# EAGLE design ventmon_t0.5i (EAGLE 9.6.2)
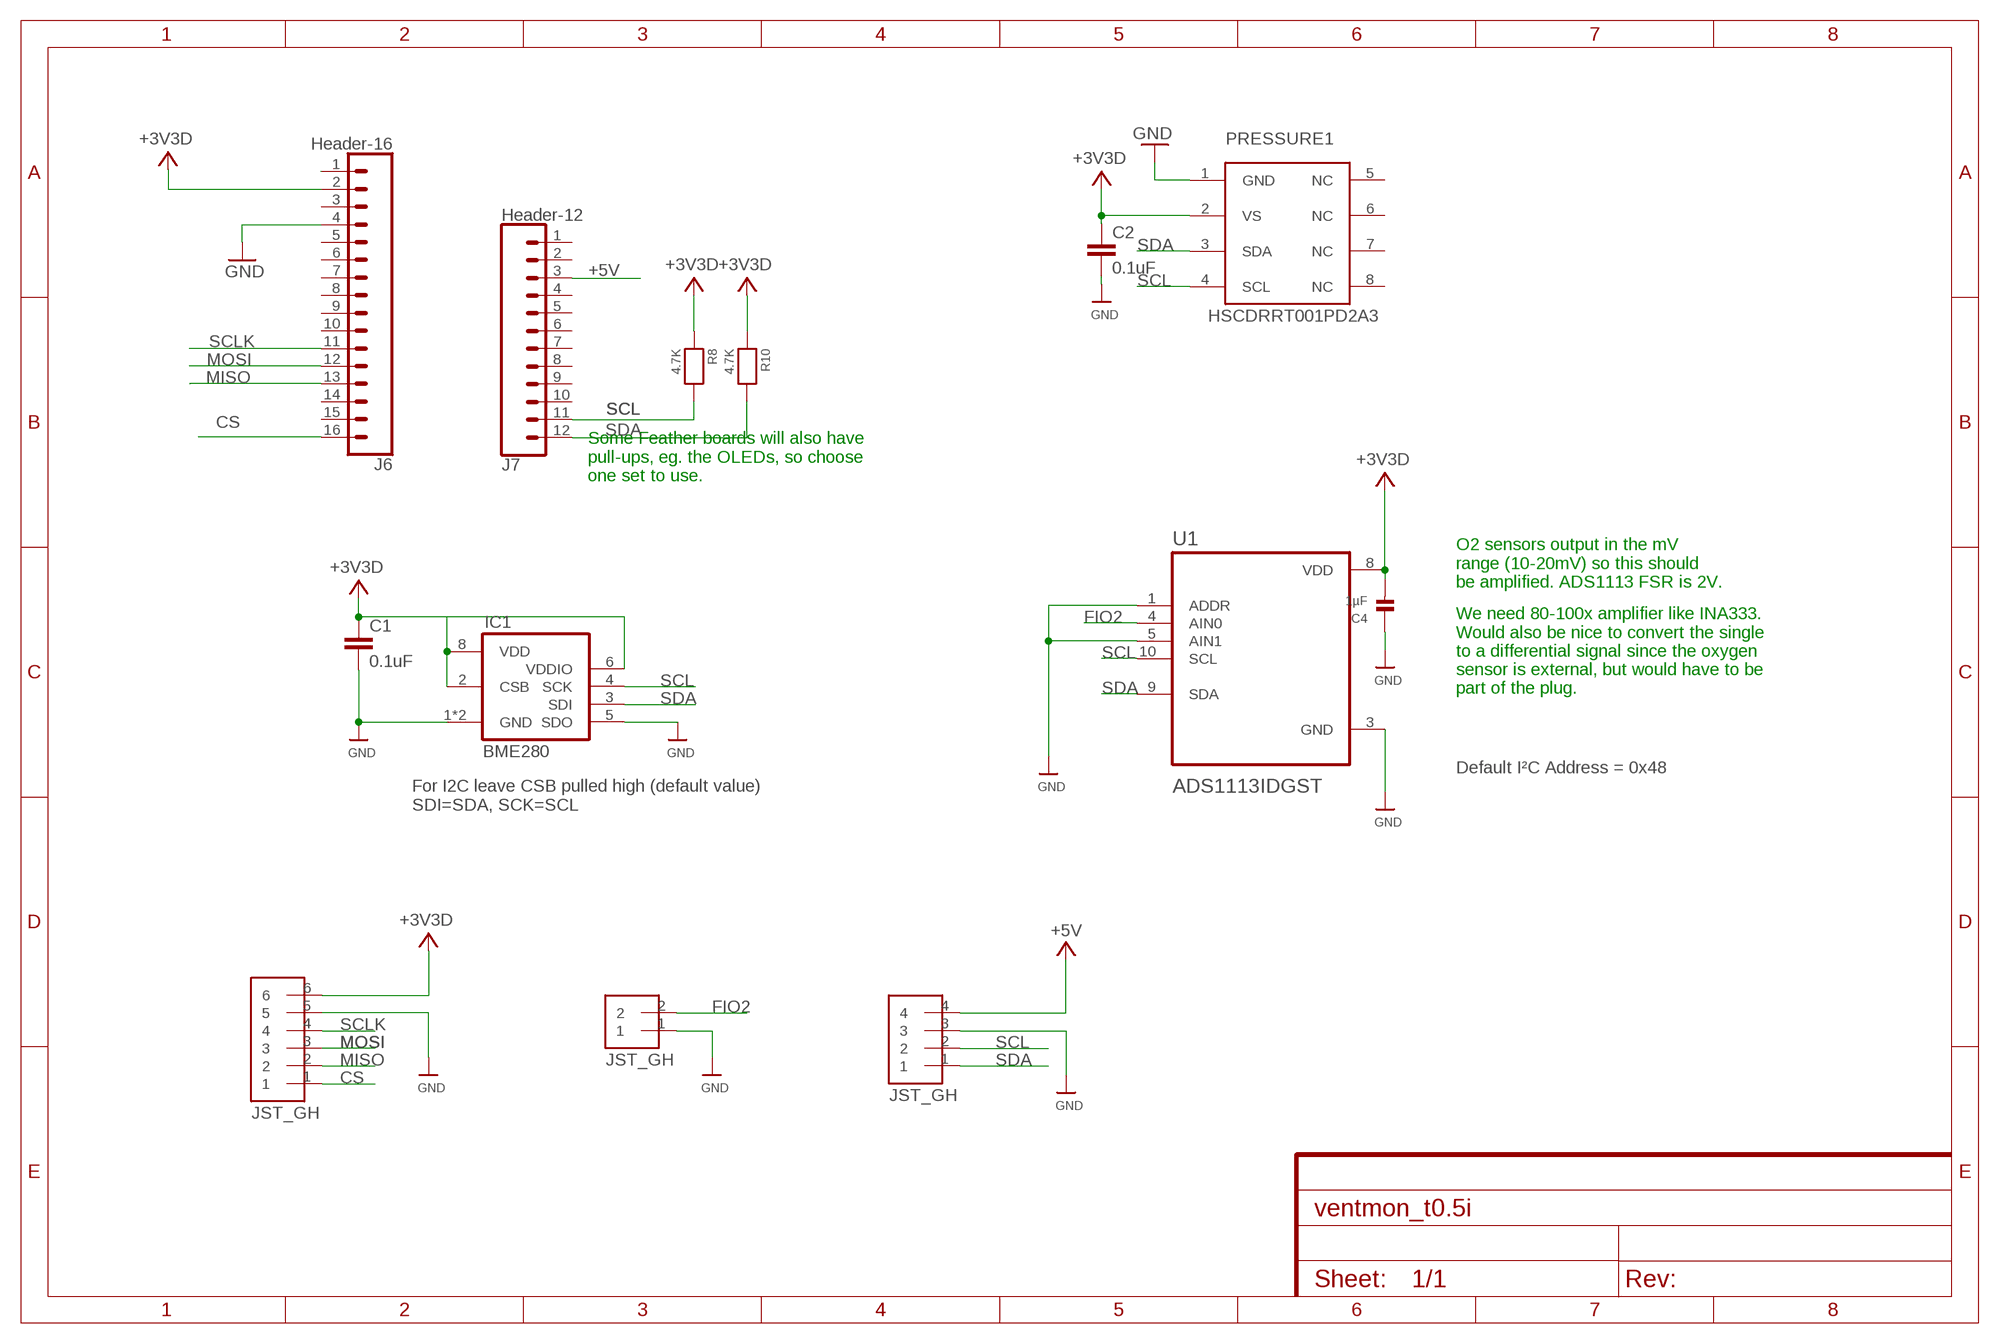
[diagram p0: schematic, sheet 1]

## Parts
C1  0.1uF  0.1UF-0603-25V-5%  [0603]
C2  0.1uF  0.1UF-0603-25V-5%  [0603]
C4  1µF  CAP_CERAMIC0603  [0603]
IC1  BME280  [BME280]
J6  Header-16  CONN_16  [1X16]
J7  Header-12  CONN_12  [1X12]
PRESSURE1  HSCDRRT001PD2A3  [DIP1330W46P254L1000H616Q8B]
R8  4.7K  RESISTOR0603  [0603]
R10  4.7K  RESISTOR0603  [0603]
U1  ADS1113IDGST  [SOP50P490X110-10N]
U$5  JST_GH_4  [JST_GH_4]
U$6  JST_GH_6  [JST_GH_6]
U$12  JST_GH_2  [JST_GH_2]

## Nets
+3V3: C1.1 C2.1 C4.2 IC1.2(CSB) IC1.6(VDDIO) IC1.8(VDD) J6.2 PRESSURE1.2(VS) R8.1 R10.1 U1.8(VDD) U$6.6 ; supply symbol labelled +3V3D
+5V: J7.3 U$5.4
CS: J6.16 U$6.1
FIO2: U1.4(AIN0) U$12.2
GND: C1.2 C2.2 C4.1 IC1.1(GND) IC1.5(SDO) IC1.7(GND) J6.4 PRESSURE1.1(GND) U1.1(ADDR) U1.3(GND) U1.5(AIN1) U$5.3 U$6.5 U$12.1
MISO: J6.13 U$6.2
MOSI: J6.12 U$6.3
N$4: J6.1
SCL: IC1.4(SCK) J7.11 PRESSURE1.4(SCL) R8.2 U1.10(SCL) U$5.2
SCLK: J6.11 U$6.4
SDA: IC1.3(SDI) J7.12 PRESSURE1.3(SDA) R10.2 U1.9(SDA) U$5.1
Unconnected: J6.3 J6.5 J6.6 J6.7 J6.8 J6.9 J6.10 J6.14 J6.15 J7.1 J7.2 J7.4 J7.5 J7.6 J7.7 J7.8 J7.9 J7.10 PRESSURE1.5(NC) PRESSURE1.6(NC) PRESSURE1.7(NC) PRESSURE1.8(NC)

## Notes on the sheet
- Some Feather boards will also have
  pull-ups, eg. the OLEDs, so choose
  one set to use.
- O2 sensors output in the mV
  range (10-20mV) so this should
  be amplified. ADS1113 FSR is 2V.
- We need 80-100x amplifier like INA333.
  Would also be nice to convert the single
  to a differential signal since the oxygen
  sensor is external, but would have to be
  part of the plug.
- Default I²C Address = 0x48
- For I2C leave CSB pulled high (default value)
  SDI=SDA, SCK=SCL

## Library data of the parts
C1 C2 = SparkFun-Capacitors:0.1UF: 0.1µF ceramic capacitors A capacitor is a passive two-terminal electrical component used to store electrical energy temporarily in an electric field.; PROD_ID: CAP-08604
C4 = microbuilder:CAP_CERAMIC: Ceramic Capacitors 0402 - 0402 Surface Mount Capacitors 16pF 50V 5% [Digikey: 445-4899-2-ND] 18pF 50V 5% [Digikey: 490-1281-2-ND] 22pF 50V 5% [Digikey: 490-1283-2-ND] 68pF 50V 5% [Digikey: 490-1289-2-ND] 0.1uF 10V 10% [Digikey: 490-1318-2-ND] 1.0uF 6.3V 10% [Digikey: 490-1320-2-ND] 0603 - 0603 Surface Mount Capacitors 16 pF 50V 5% [Digikey: 445-5051-2-ND] 22 pF 50V [Digikey: PCC220ACVTR-ND] 33 pF 50V 5% [Digikey: 490-1415-1-ND] 56pF 50V 5% [Digikey: 490-1421-1-ND] 220pF 50V 5% [Digikey: 445-1285-1-ND] 680 pF 50V 2200 pF 50V 5% C0G [Digikey: 445-1297-1-ND] 5600 pF 100V 5% X7R [Digikey: 478-3711-1-ND] 0.1 µF 25V 10% [Digikey: PCC2277TR-ND] 0.22 µF 16V 10% X7R [Digikey: 445-1318-1-ND] 1.0 µF 25V 10% [Digikey: 445-5146-2-ND] 0603 - RF Specific 3pF 250V +/-0.1pF RF [Digikey: 712-1347-1-ND] 18 pF 250V 5% [Digikey: 478-3505-1-ND or 712-1322-1-ND] 56 pF 250V 5% C0G RF [Digikey: 490-4867-1-ND] 68 pF 250V RF [Digikey: 490-4868-1-ND] 0805 - 0805 Surface Mount Capacitors 220 pF 250V 2% RF Ceramic Capacitor [Digikey: 712-1398-1-ND] 1000 pF 50V 2% NP0 Ceramic Capacitor [Digikey: 478-3760-1-ND] 0.1 µF 25V 10% Ceramic Capacitor [Digikey: PCC1828TR-ND] 1.0 µF 16V 10% Ceramic Capacitor[Digikey: 490-1691-2-ND] 10.0 µF 10V 10% Ceramic Capacitor[Digikey: 709-1228-1-ND] 10.0 uF 16V 10% Ceramic Capacitor [Digikey: 478-5165-2-ND] 47 uF 6.3V 20% Ceramic Capacitor [Digikey: 587-1779-1-ND or 399-5506-1-ND] 1206 - 1206 Surface Mount Capacitors 47uF 10V 20% Ceramic Capacitor [Digikey: 490-5528-1-ND or 399-5508-1-ND or 445-6010-1-ND] 100uF 6.3V -20%, +80% Y5V Ceramic Capacitor (Digikey: 490-4512-1-ND, Mouser: 81-GRM31CF50J107ZE1L)
IC1 = bosch-bme280:BME280: DIGITAL HUMIDITY, PRESSURE AND TEMPERATURE SENSOR * Digital interface I²C (up to 3.4 MHz) and SPI (3 and 4 wire, up to 10 MHz)* Supply voltage VDD main supply voltage range: 1.71 V to 3.6 V*VDDIO interface voltage range: 1.2 V to 3.6 V Operating range -40…+85 °C, 0…100 % rel. humidity, 300…1100 hPa The library has been designed by Richard Magdycz <https://www.facebook.com/groups/eaglecadsoftUK>
J6 = SparkFun-Connectors:CONN_16: Multi connection point. Often used as Generic Header-pin footprint for 0.1 inch spaced/style header connections On any of the 0.1 inch spaced packages, you can populate with these: Break Away Headers - Straight <https://www.sparkfun.com/products/116> (PRT-00116) Break Away Male Headers - Right Angle <https://www.sparkfun.com/products/553> (PRT-00553) Female Headers <https://www.sparkfun.com/products/115> (PRT-00115) Break Away Headers - Machine Pin <https://www.sparkfun.com/products/117> (PRT-00117) Break Away Female Headers - Swiss Machine Pin <https://www.sparkfun.com/products/743> (PRT-00743) For SCREWTERMINALS and SPRING TERMINALS visit here: Screw Terimnals on SparkFun.com <https://www.sparkfun.com/search/results?term=Screw+Terminals> (5mm/3.5mm/2.54mm spacing) This device is also useful as a general connection point to wire up your design to another part of your project. Our various solder wires solder well into these plated through hole pads. Hook-Up Wire - Assortment (Stranded, 22 AWG) <https://www.sparkfun.com/products/11375> (PRT-11375) Hook-Up Wire - Assortment (Solid Core, 22 AWG) <https://www.sparkfun.com/products/11367> (PRT-11367) View the entire wire category on our website here <https://www.sparkfun.com/categories/141> Special notes: Molex polarized connector foot print use with SKU : PRT-08231 with associated crimp pins and housings. 1MM SMD Version SKU: PRT-10208 NOTES ON THE VARIANTS LOCK and LOCK_LONGPADS... This footprint was designed to help hold the alignment of a through-hole component (i.e. 6-pin header) while soldering it into place. You may notice that each hole has been shifted either up or down by 0.005 of an inch from it's more standard position (which is a perfectly straight line). This slight alteration caused the pins (the squares in the middle) to touch the edges of the holes. Because they are alternating, it causes a "brace" to hold the component in place. 0.005 has proven to be the perfect amount of "off-center" position when using our standard breakaway headers. Although looks a little odd when you look at the bare footprint, once you have a header in there, the alteration is very hard to notice. Also,if you push a header all the way into place, it is covered up entirely on the bottom side.
J7 = SparkFun-Connectors:CONN_12: Multi connection point. Often used as Generic Header-pin footprint for 0.1 inch spaced/style header connections On any of the 0.1 inch spaced packages, you can populate with these: Break Away Headers - Straight <https://www.sparkfun.com/products/116> (PRT-00116) Break Away Male Headers - Right Angle <https://www.sparkfun.com/products/553> (PRT-00553) Female Headers <https://www.sparkfun.com/products/115> (PRT-00115) Break Away Headers - Machine Pin <https://www.sparkfun.com/products/117> (PRT-00117) Break Away Female Headers - Swiss Machine Pin <https://www.sparkfun.com/products/743> (PRT-00743) For SCREWTERMINALS and SPRING TERMINALS visit here: Screw Terimnals on SparkFun.com <https://www.sparkfun.com/search/results?term=Screw+Terminals> (5mm/3.5mm/2.54mm spacing) This device is also useful as a general connection point to wire up your design to another part of your project. Our various solder wires solder well into these plated through hole pads. Hook-Up Wire - Assortment (Stranded, 22 AWG) <https://www.sparkfun.com/products/11375> (PRT-11375) Hook-Up Wire - Assortment (Solid Core, 22 AWG) <https://www.sparkfun.com/products/11367> (PRT-11367) View the entire wire category on our website here <https://www.sparkfun.com/categories/141> Special notes: Molex polarized connector foot print use with SKU : PRT-08231 with associated crimp pins and housings. 1MM SMD Version SKU: PRT-10208 NOTES ON THE VARIANTS LOCK and LOCK_LONGPADS... This footprint was designed to help hold the alignment of a through-hole component (i.e. 6-pin header) while soldering it into place. You may notice that each hole has been shifted either up or down by 0.005 of an inch from it's more standard position (which is a perfectly straight line). This slight alteration caused the pins (the squares in the middle) to touch the edges of the holes. Because they are alternating, it causes a "brace" to hold the component in place. 0.005 has proven to be the perfect amount of "off-center" position when using our standard breakaway headers. Although looks a little odd when you look at the bare footprint, once you have a header in there, the alteration is very hard to notice. Also,if you push a header all the way into place, it is covered up entirely on the bottom side.
PRESSURE1 = HSCDRRT001PD2A3:HSCDRRT001PD2A3: Honeywell Differential Pressure Sensor Pressure Sensor ±1PSI (±6.89kPa) Differential Male - 0.08" (1.93mm) Tube, Dual 12 b 8-DIP (0.524", 13.30mm), Dual Ports, Same Side, I2C https://www.digikey.com/product-detail/en/honeywell-sensing-and-productivity-solutions/HSCDRRT001PD2A3/480-3335-ND/2601662
R8 R10 = microbuilder:RESISTOR: Resistors 0402 - 0402 Surface Mount Package 22 Ohm 1% 1/16W [Digikey: 311-22.0LRTR-ND] 33 Ohm 5% 1/16W 1.0K 5% 1/16W 1.5K 5% 1/16W 2.0K 1% 1/16W 10.0K 1% 1/16W [Digikey: 311-10.0KLRTR-ND] 10.0K 5% 1/16W [Digikey: RMCF0402JT10K0TR-ND] 12.1K 1% 1/16W [Digikey: 311-22.0LRTR-ND] 100.0K 5% 1/16W 0603 - 0603 Surface Mount Package 0 Ohm 1/10 Watt 1% Resistor 15 Ohm 1/10 Watt 1% Resistor 33 Ohm 1/10 Watt 1% Resistor 49.9 Ohm 1/10 Watt 1% Resistor 100 Ohm 1/10 Watt 1% Resistor 150 Ohm 1/10 Watt 1% Resistor 240 Ohm 1/10 Watt 1% Resistor 390 Ohm 1/10 Watt 1% Resistor 560 Ohm 1/10 Watt 1% Resistor 680 Ohm 1/10 Watt 1% Resistor 750 Ohm 1/10 Watt 1% Resistor 1.0K Ohm 1/10 Watt 1% Resistor 1.5K Ohm 1/10 Watt 1% Resistor 2.0K Ohm 1/10 Watt 1% Resistor 2.2K Ohm 1/10 Watt 1% Resistor 3.3K Ohm 1/10 Watt 1% Resistor 4.7K Ohm 1/10 Watt 1% Resistor 10.0K Ohm 1/10 Watt 1% Resistor 12.0K Ohm 1/10 Watt 1% Resistor 12.1K Ohm 1/10 Watt 1% Resistor 20.0K Ohm 1/10 Watt 1% Resistor 33.0K Ohm 1/10 Watt 1% Resistor 100.0K Ohm 1/10 Watt 1% Resistor 0805 - 0805 Surface Mount Package 0 Ohm 1/8 Watt 1% Resistor 33 Ohm 1/8 Watt 1% Resistor 100 Ohm 1/8 Watt 1% Resistor 150 Ohm 1/8 Watt 1% Resistor 200 Ohm 1/8 Watt 1% Resistor 240 Ohm 1/8 Watt 1% Resistor 330 Ohm 1/8 Watt 1% Resistor 390 Ohm 1/8 Watt 1% Resistor 470 Ohm 1/8 Watt 1% Resistor 1.0K Ohm 1/8 Watt 1% Resistor 1.5K Ohm 1/8 Watt 1% Resistor 2.0K Ohm 1/8 Watt 1% Resistor 4.7K Ohm 1/8 Watt 1% Resistor 5.1K Ohm 1/8 Watt 1% Resistor 5.6K Ohm 1/8 Watt 1% Resistor 10.0K Ohm 1/8 Watt 1% Resistor 22.0K Ohm 1/8 Watt 1% Resistor 33.0K Ohm 1/8 Watt 1% Resistor 100K Ohm 1/8 Watt 1% Resistor 1206 - 1206 Surface Mount Package 2012 - 2010 Surface Mount Package 0.11 Ohm 1/2 Watt 1% Resistor - Digikey: RHM.11UCT-ND
U1 = ADS1113IDGST:ADS1113IDGST; DESCRIPTION: 16-Bit 860SPS 1-Ch Delta-Sigma ADC With Oscillator, Voltage Reference, and I2C; DIGI-KEY_PART_NUMBER: 296-24930-2-ND; MF: Texas Instruments; MP: ADS1113IDGST; PACKAGE: VSSOP-10 Texas Instruments; PURCHASE-URL: https://pricing.snapeda.com/search/part/ADS1113IDGST/?ref=eda
U$5 = ben:JST_GH_4
U$6 = ben:JST_GH_6
U$12 = ben:JST_GH_2

## Board
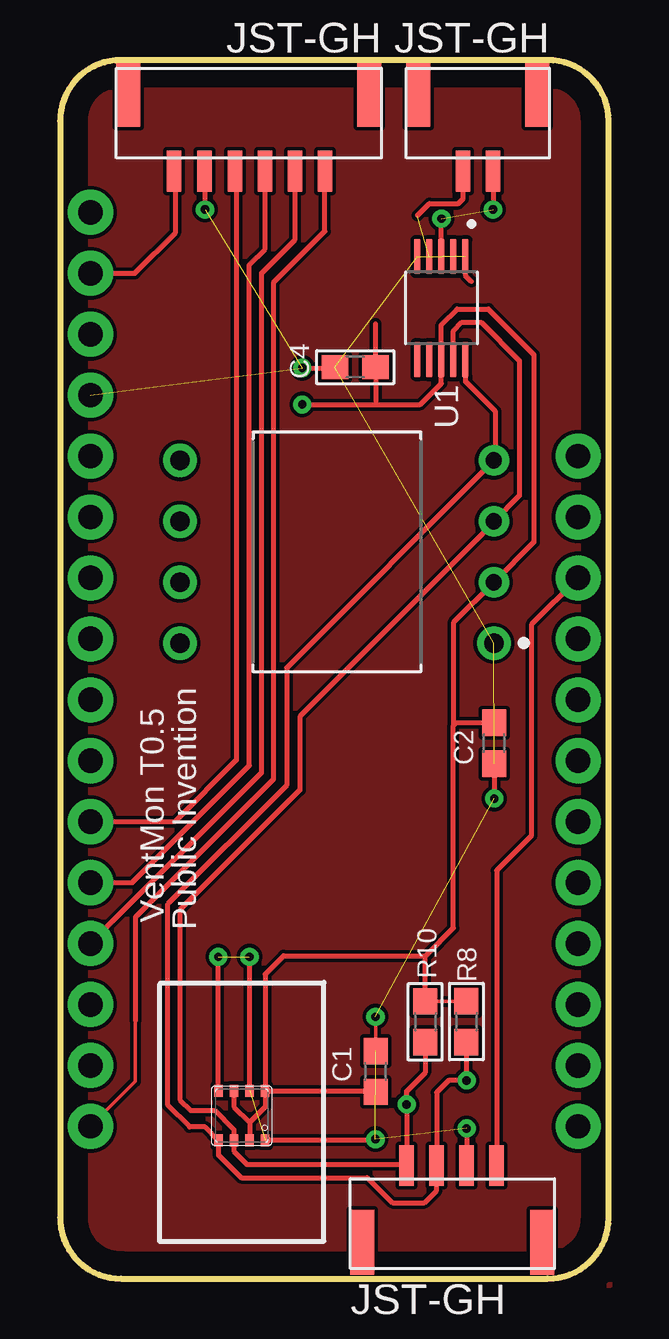
[diagram p1: board, top side]
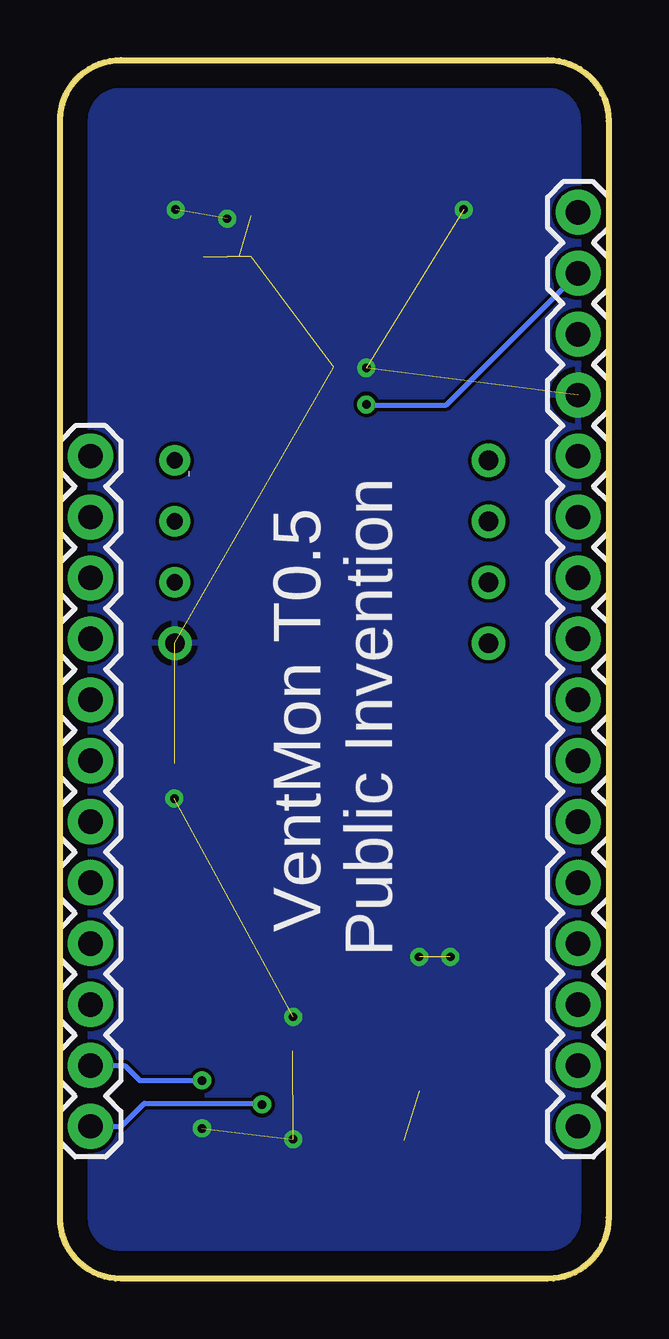
[diagram p2: board, bottom side, seen from below]

Size 22.86 x 50.8 mm. Coordinates in mm from the lower left corner, seen from the top.
Outline: 20.32,50.8 2.54,50.8 arc90 0,48.26 0,2.54 arc90 2.54,0 20.32,0 arc90 22.86,2.54 22.86,48.26 arc90 20.32,50.8
Copper layers (1*16): Top 0.035mm / dielectric 1.5mm / Bottom 0.035mm
Design rules "default *": minimum track width 6mil, minimum drill 10mil, track to track 6mil, track to pad 6mil, pad to pad 6mil, via to via 6mil, smd to smd 6mil, copper to edge 40mil, drill to drill 6mil, minimum pad ring 10mil, minimum via ring 8mil, stop-mask expansion 4mil, vias tented up to drill 0.35mm, thermal gap 10mil

### Footprints (pad centres in the part's own frame; a part is rotated, then mirrored left to right if it is on the bottom)
0603 = smd 1.1 x 1: 1 -0.85,0; 2 0.85,0
BME280 = smd 0.35 x 0.5: 1 0.975,-1.025; 2 0.325,-1.025; 3 -0.325,-1.025; 4 -0.975,-1.025; 5 -0.975,1.025; 6 -0.325,1.025; 7 0.325,1.025; 8 0.975,1.025
1X16 = drill 1.016 pad 1.88: 1 0,0; 2 2.54,0; 3 5.08,0; 4 7.62,0; 5 10.16,0; 6 12.7,0; 7 15.24,0; 8 17.78,0; 9 20.32,0; 10 22.86,0; 11 25.4,0; 12 27.94,0; 13 30.48,0; 14 33.02,0; 15 35.56,0; 16 38.1,0
1X12 = drill 1.016 pad 1.88: 1 0,0; 2 2.54,0; 3 5.08,0; 4 7.62,0; 5 10.16,0; 6 12.7,0; 7 15.24,0; 8 17.78,0; 9 20.32,0; 10 22.86,0; 11 25.4,0; 12 27.94,0
DIP1330W46P254L1000H616Q8B = drill 0.813 pad 1.397: 1 -6.54,3.81; 5 6.54,-3.81; 6 6.54,-1.27; 7 6.54,1.27; 8 6.54,3.81 | drill 0.675 pad 1.275: 2 -6.54,1.27; 3 -6.54,-1.27; 4 -6.54,-3.81
SOP50P490X110-10N = smd 1.47 x 0.28: 1 -2.15,1; 2 -2.15,0.5; 3 -2.15,0; 4 -2.15,-0.5; 5 -2.15,-1; 6 2.15,-1; 7 2.15,-0.5; 8 2.15,0; 9 2.15,0.5; 10 2.15,1
JST_GH_4 = smd 0.6 x 1.7: 1 2.35,4.55; 2 3.6,4.55; 3 4.85,4.55; 4 6.1,4.55 | smd 1 x 2.7: NC1 0.5,1.35; NC2 8,1.35
JST_GH_6 = smd 0.6 x 1.7: 1 2.35,4.55; 2 3.6,4.55; 3 4.85,4.55; 4 6.1,4.55; 5 7.37,4.55; 6 8.64,4.55 | smd 1 x 2.7: NC1 0.5,1.35; NC2 10.54,1.35
JST_GH_2 = smd 0.6 x 1.7: 1 2.35,4.55; 2 3.6,4.55 | smd 1 x 2.7: NC1 0.5,1.35; NC2 5.46,1.35

### Placement (x,y rotation side)
C1  13.15,8.64 90 top
C2  18.08,22.32 270 top
C4  12.3,38 0 top
IC1  7.57,6.8 0 top
J6  1.27,44.45 270 bottom
J7  21.59,34.29 270 bottom
PRESSURE1  11.54,30.3 180 top
R8  16.93,10.72 270 top
R10  15.22,10.71 270 top
U1  15.89,40.46 270 top
U$5  12.09,0.17 0 top
U$6  13.39,50.72 180 top
U$12  20.39,50.72 180 top

### Tracks (layer width: path | path; a pad name or v marks a point on that pad's centre or on a via)
+3V3  (via drill 0.35)
  Top 0.152: R10.1 16.92,11.56 R8.1
  Top 0.2: 16.39,23.07 16.39,27.35 PRESSURE1.2 19.75,30.7 19.75,38.51 17.84,40.42 16.54,40.42 15.89,39.76 U1.8 15.89,37.32 15.02,36.44 13.15,36.44 | 13.15,36.44 C4.2 13.15,39.8 | J6.2 3.12,41.91 4.79,43.58 4.79,46.13 U$6.6 | v10.09,36.44 13.15,36.44 | IC1.6 7.24,7.17 7.9,6.51 | 7.9,6.51 IC1.2 | IC1.8 8.55,7.16 7.9,6.51 | C2.1 16.5,23.17 16.39,23.07 | 15.24,13.47 9.32,13.47 8.55,12.69 IC1.8 | 15.24,13.47 16.39,14.62 16.39,23.07 | IC1.8 13.12,7.82 C1.1 | R10.1 15.21,13.44 15.24,13.47
  Bottom 0.2: J6.2 6.76,36.42 10.07,36.42 v10.09,36.44
+5V
  Top 0.2: J7.3 19.64,27.26 19.64,18.47 18.19,17.02 U$5.4
CS
  Top 0.152: 3.14,10.76 3.14,8.22 J6.16
  Top 0.2: U$6.1 11.04,43.66 8.89,41.52 8.89,20.81 3.14,15.06 3.14,10.76
FIO2  (1 unrouted)
  Top 0.2: 14.89,44.31 15.39,44.82 16.59,44.82 16.79,45.02 U$12.2
GND  (via drill 0.35)  (13 unrouted)
  Top 0.152: C1.2 v13.15,10.91 v13.14,10.92
  Top 0.2: U$12.1 v18.04,44.57 | v10.09,37.97 10.11,37.95 11.4,37.95 C4.1 | U$6.5 6.02,44.59 v6.04,44.57 | IC1.1 13.1,5.77 v13.14,5.82 | IC1.7 v7.9,13.41 v7.89,13.42 | IC1.5 v6.6,13.41 v6.59,13.42 | v16.94,6.27 U$5.3 | C2.2 v18.08,20.03 v18.09,20.02 | U1.3 v15.89,44.18 v15.89,44.19 | 17.14,41.57 16.89,41.82 U1.1
  pour Bottom: 22.98,51.05 22.98,-0.2 -0.09,-0.2 -0.09,51.24
MISO
  Top 0.2: J6.13 8.4,21.1 8.4,41.92 9.79,43.32 U$6.2
MOSI
  Top 0.2: J6.12 3.02,16.51 7.89,21.38 7.89,42.27 8.54,42.92 U$6.3
N$1
  pour Top: 0.04,51.02 0.04,-0.25 22.91,-0.25 22.91,51.02
SCL  (via drill 0.35)
  Top 0.2: U1.10 16.89,37.41 18.14,36.16 18.14,34.17 PRESSURE1.4 9.44,25.47 9.44,20.57 4.49,15.62 4.49,7.22 5.4,6.32 6.05,6.32 IC1.4 6.6,5.16 7.54,4.22 12.79,4.22 13.84,3.17 15.19,3.17 15.69,3.67 U$5.2 15.69,7.77 16.19,8.27 v16.94,8.27 16.93,8.28 R8.2
  Bottom 0.2: J7.11 20.17,8.89 19.54,8.27 v16.94,8.27
SCLK
  Top 0.2: U$6.4 7.34,46.12 7.34,21.62 4.78,19.05 J6.11
SDA  (via drill 0.35)
  Top 0.2: U1.9 16.39,39.51 16.74,39.86 17.55,39.86 19.14,38.27 19.14,32.64 PRESSURE1.3 18.08,31.52 9.99,23.43 9.99,20.37 4.99,15.37 4.99,7.47 5.44,7.02 6.44,7.02 7.25,6.21 IC1.3 7.25,5.31 7.79,4.77 14.39,4.77 U$5.1 v14.44,7.27 14.44,7.82 15.21,8.59 R10.2
  Bottom 0.2: J7.12 20.31,6.35 19.34,7.32 14.49,7.32 v14.44,7.27

### Text on the board
tPlace: VentMon T0.5 | Public Invention
bPlace: Public Invention | VentMon T0.5